# Altium schematic sheet [08] - MCU.SchDoc
size A3; SheetNumber: 8; SheetTotal: 9
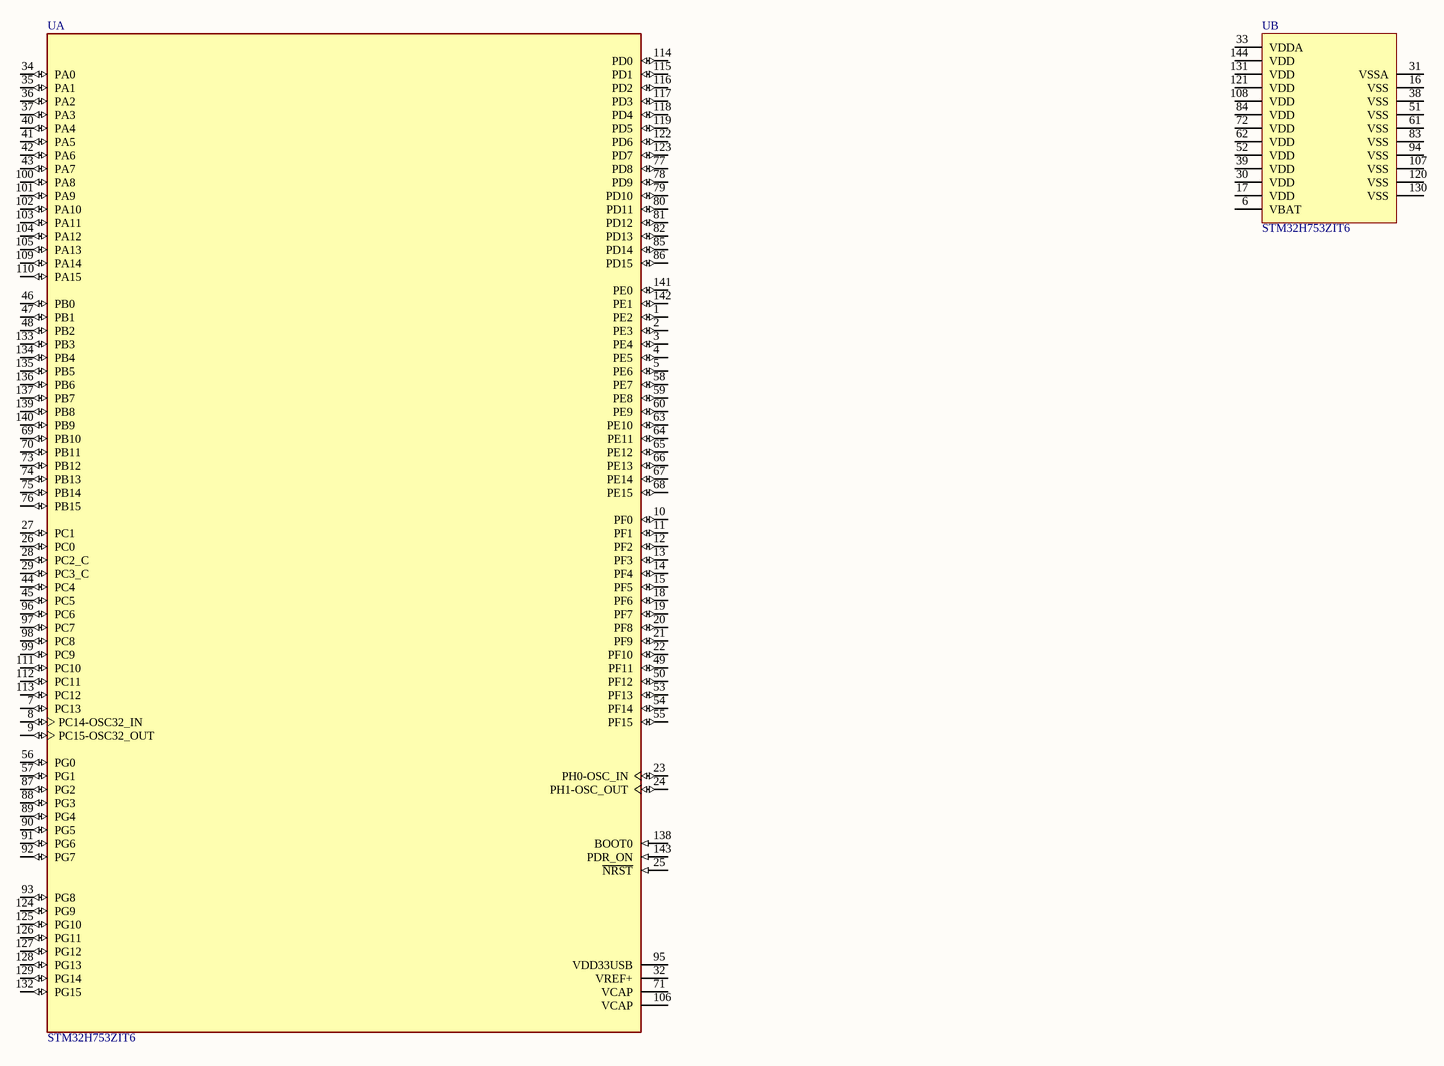
[diagram p0: [08] - MCU.SchDoc]

## Parts
U  STM32H753ZIT6  [ST_MCU_STM32H753ZIT6_LQFP144]  (parts A,B of 2)

## Nets

Not connected (* = marked no-connect by the designer): U 1(PE2) 2(PE3) 3(PE4) 4(PE5) 5(PE6) 6(VBAT) 7(PC13) 8(PC14-OSC32_IN) 9(PC15-OSC32_OUT) 10(PF0) 11(PF1) 12(PF2) 13(PF3) 14(PF4) 15(PF5) 16(VSS) 17(VDD) 18(PF6) 19(PF7) 20(PF8) 21(PF9) 22(PF10) 23(PH0-OSC_IN) 24(PH1-OSC_OUT) 25(~{NRST}) 26(PC0) 27(PC1) 28(PC2_C) 29(PC3_C) 30(VDD) 31(VSSA) 32(VREF+) 33(VDDA) 34(PA0) 35(PA1) 36(PA2) 37(PA3) 38(VSS) 39(VDD) 40(PA4) 41(PA5) 42(PA6) 43(PA7) 44(PC4) 45(PC5) 46(PB0) 47(PB1) 48(PB2) 49(PF11) 50(PF12) 51(VSS) 52(VDD) 53(PF13) 54(PF14) 55(PF15) 56(PG0) 57(PG1) 58(PE7) 59(PE8) 60(PE9) 61(VSS) 62(VDD) 63(PE10) 64(PE11) 65(PE12) 66(PE13) 67(PE14) 68(PE15) 69(PB10) 70(PB11) 71(VCAP) 72(VDD) 73(PB12) 74(PB13) 75(PB14) 76(PB15) 77(PD8) 78(PD9) 79(PD10) 80(PD11) 81(PD12) 82(PD13) 83(VSS) 84(VDD) 85(PD14) 86(PD15) 87(PG2) 88(PG3) 89(PG4) 90(PG5) 91(PG6) 92(PG7) 93(PG8) 94(VSS) 95(VDD33USB) 96(PC6) 97(PC7) 98(PC8) 99(PC9) 100(PA8) 101(PA9) 102(PA10) 103(PA11) 104(PA12) 105(PA13) 106(VCAP) 107(VSS) 108(VDD) 109(PA14) 110(PA15) 111(PC10) 112(PC11) 113(PC12) 114(PD0) 115(PD1) 116(PD2) 117(PD3) 118(PD4) 119(PD5) 120(VSS) 121(VDD) 122(PD6) 123(PD7) 124(PG9) 125(PG10) 126(PG11) 127(PG12) 128(PG13) 129(PG14) 130(VSS) 131(VDD) 132(PG15) 133(PB3) 134(PB4) 135(PB5) 136(PB6) 137(PB7) 138(BOOT0) 139(PB8) 140(PB9) 141(PE0) 142(PE1) 143(PDR_ON) 144(VDD)

## Library data of the parts
U = STM32H753ZIT6: ARMÂ® CortexÂ®-M7 STM32H7 Microcontroller IC 32-Bit 480MHz 2MB _2M x 8_ FLASH 144-LQFP _20x20_; MF: STMicroelectronics; Package: LQFP-144 STMicroelectronics; Value: *; SnapEDA_Link: https://www.snapeda.com/parts/STM32H753ZIT6/STMicroelectronics/view-part/2461811/?ref=snap; MP: STM32H753ZIT6; Supplier: Mouser; Supplier URL: https://www.mouser.vn/ProductDetail/STMicroelectronics/STM32H753ZIT6?qs=u4fy%2FsgLU9PzR9vtNNw%2FMw%3D%3D; ComponentLink1Description: Datasheet; ComponentLink1URL: https://www.st.com/resource/en/datasheet/stm32h753vi.pdf